# EAGLE design 8052 (EAGLE 9.3.0)
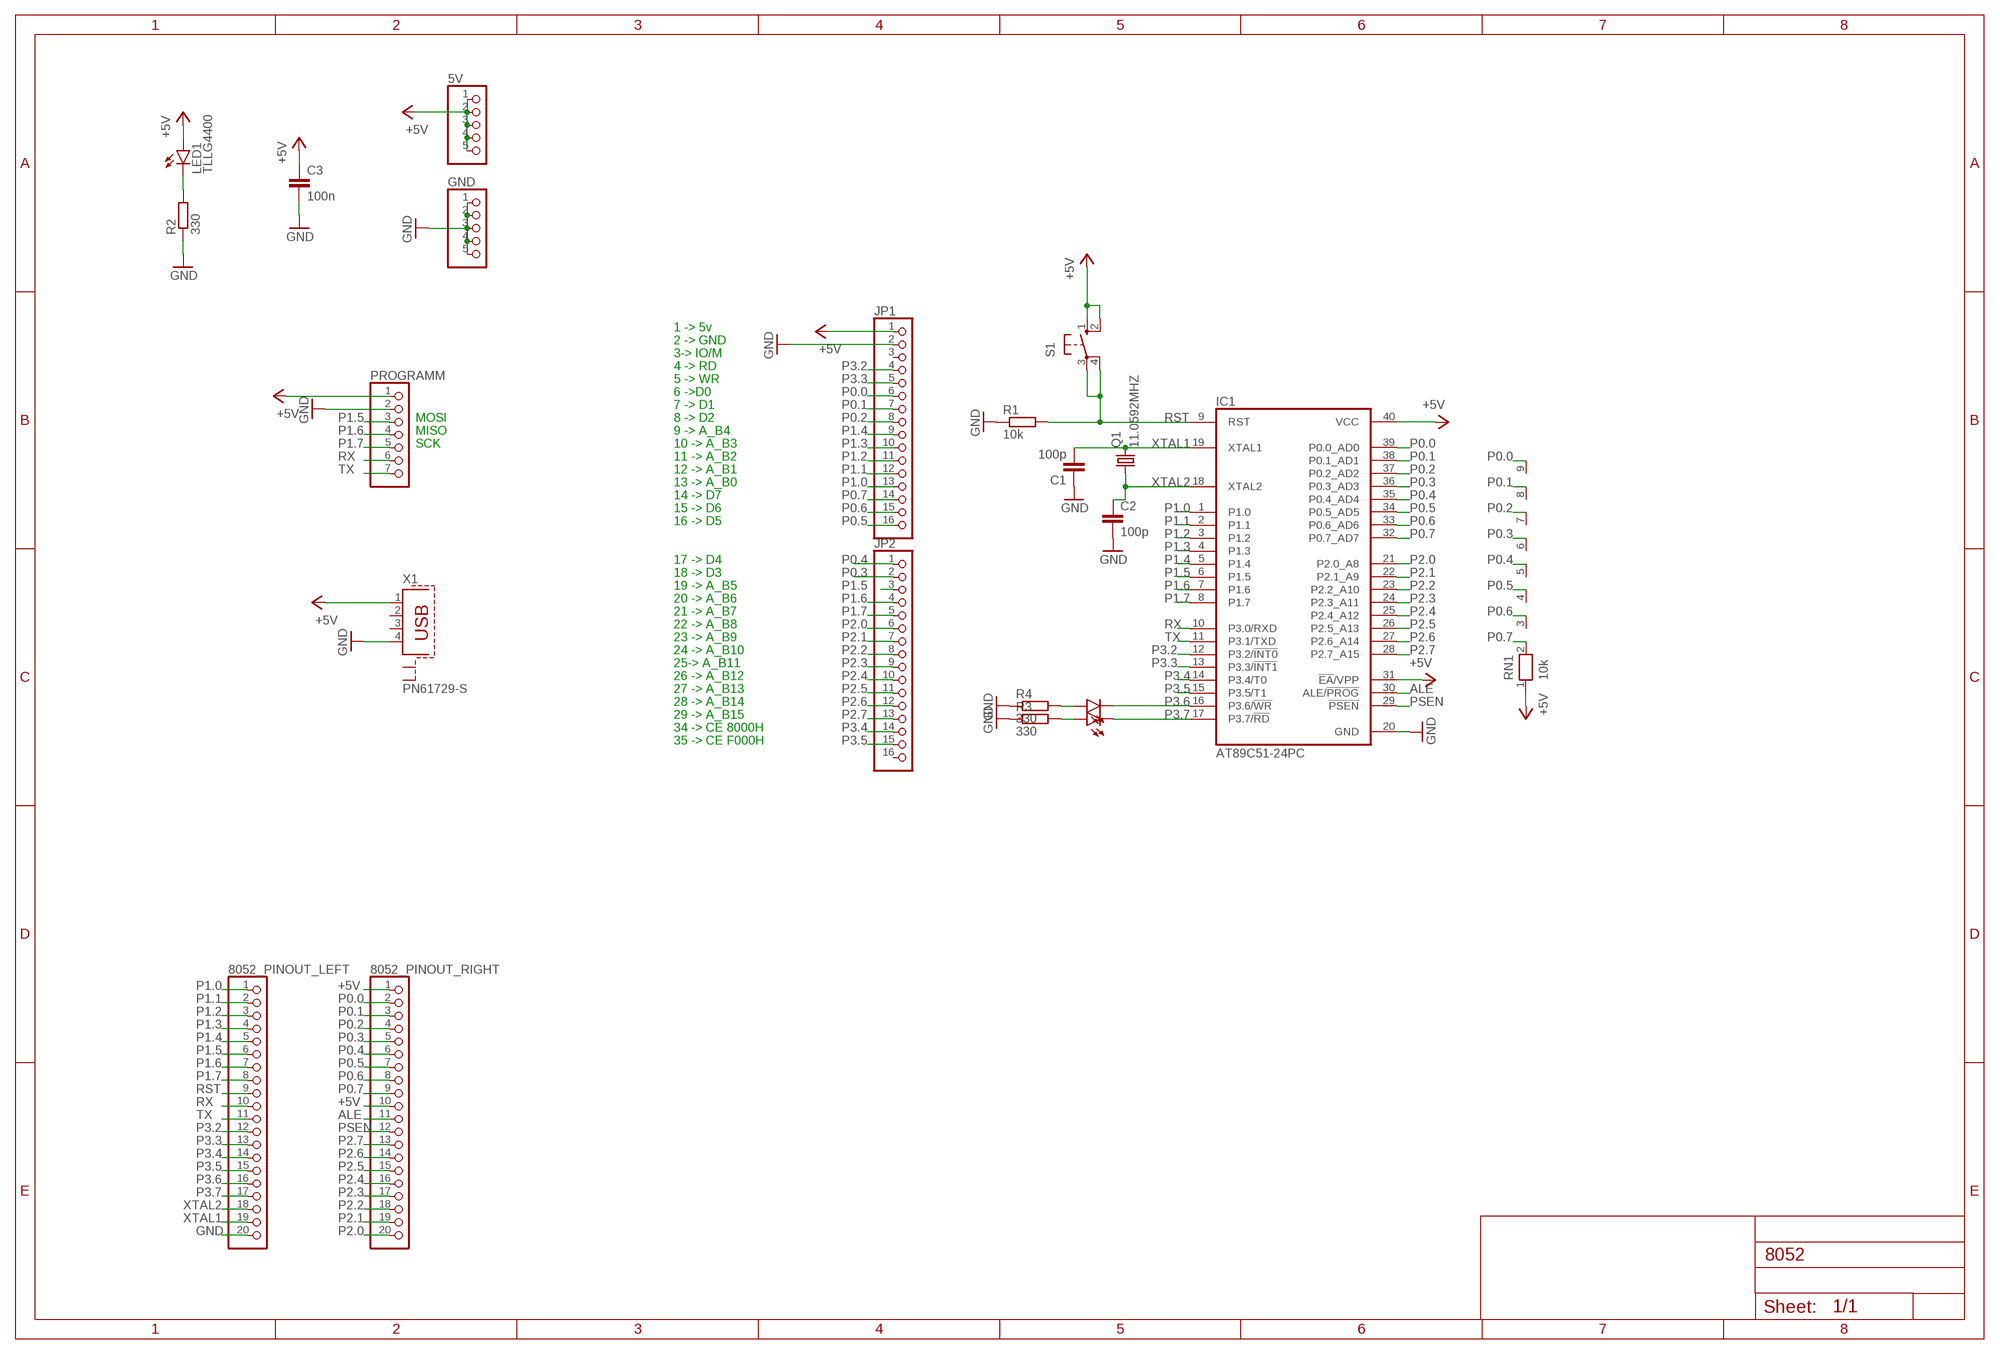
[diagram p0: schematic, sheet 1]

## Parts
5V  PINHD-1X5  [1X05]
8052_PINOUT_LEFT  PINHD-1X20  [1X20]
8052_PINOUT_RIGHT  PINHD-1X20  [1X20]
C1  100p  C-EU025-024X044  [C025-024X044]
C2  100p  C-EU025-024X044  [C025-024X044]
C3  100n  C-EU025-025X050  [C025-025X050]
GND  PINHD-1X5  [1X05]
IC1  AT89C51-24PC  [DIL40]
JP1  PINHD-1X16  [1X16]
JP2  PINHD-1X16  [1X16]
LED1  TLLG4400  [LED3MM]
LED2  TLLG4400  [LED3MM]
LED3  TLLG4400  [LED3MM]
PROGRAMM  PINHD-1X7/90  [1X07/90]
Q1  11.0592MHZ  CRYSTALHC49S  [HC49/S]
R1  10k  R-EU_0207/7  [0207/7]
R2  330  R-EU_0207/7  [0207/7]
R3  330  R-EU_0207/7  [0207/7]
R4  330  R-EU_0207/7  [0207/7]
RN1  10k  RN08  [RN-9]
S1  10-XX  [B3F-10XX]
X1  PN61729-S  [PN61729-S]

## Nets
+5V: 5V.1 5V.2 5V.3 5V.4 5V.5 8052_PINOUT_RIGHT.1 8052_PINOUT_RIGHT.10 C3.1 IC1.31(!EA!/VPP) IC1.40(VCC) JP1.1 LED1.A PROGRAMM.1 RN1.1 S1.1(S) S1.2(S1) X1.1
ALE: 8052_PINOUT_RIGHT.11 IC1.30(ALE/!PROG)
GND: 8052_PINOUT_LEFT.20 C1.1 C2.2 C3.2 GND.1 GND.2 GND.3 GND.4 GND.5 IC1.20(GND) JP1.2 PROGRAMM.2 R1.1 R2.1 R3.1 R4.1 X1.4
N$1: LED1.K(C) R2.2
N$2: LED3.A R3.2
N$3: LED2.A R4.2
P0.0: 8052_PINOUT_RIGHT.2 IC1.39(P0.0_AD0) JP1.6 RN1.9
P0.1: 8052_PINOUT_RIGHT.3 IC1.38(P0.1_AD1) JP1.7 RN1.8
P0.2: 8052_PINOUT_RIGHT.4 IC1.37(P0.2_AD2) JP1.8 RN1.7
P0.3: 8052_PINOUT_RIGHT.5 IC1.36(P0.3_AD3) JP2.2 RN1.6
P0.4: 8052_PINOUT_RIGHT.6 IC1.35(P0.4_AD4) JP2.1 RN1.5
P0.5: 8052_PINOUT_RIGHT.7 IC1.34(P0.5_AD5) JP1.16 RN1.4
P0.6: 8052_PINOUT_RIGHT.8 IC1.33(P0.6_AD6) JP1.15 RN1.3
P0.7: 8052_PINOUT_RIGHT.9 IC1.32(P0.7_AD7) JP1.14 RN1.2
P1.0: 8052_PINOUT_LEFT.1 IC1.1(P1.0) JP1.13
P1.1: 8052_PINOUT_LEFT.2 IC1.2(P1.1) JP1.12
P1.2: 8052_PINOUT_LEFT.3 IC1.3(P1.2) JP1.11
P1.3: 8052_PINOUT_LEFT.4 IC1.4(P1.3) JP1.10
P1.4: 8052_PINOUT_LEFT.5 IC1.5(P1.4) JP1.9
P1.5: 8052_PINOUT_LEFT.6 IC1.6(P1.5) JP2.3 PROGRAMM.3
P1.6: 8052_PINOUT_LEFT.7 IC1.7(P1.6) JP2.4 PROGRAMM.4
P1.7: 8052_PINOUT_LEFT.8 IC1.8(P1.7) JP2.5 PROGRAMM.5
P2.0: 8052_PINOUT_RIGHT.20 IC1.21(P2.0_A8) JP2.6
P2.1: 8052_PINOUT_RIGHT.19 IC1.22(P2.1_A9) JP2.7
P2.2: 8052_PINOUT_RIGHT.18 IC1.23(P2.2_A10) JP2.8
P2.3: 8052_PINOUT_RIGHT.17 IC1.24(P2.3_A11) JP2.9
P2.4: 8052_PINOUT_RIGHT.16 IC1.25(P2.4_A12) JP2.10
P2.5: 8052_PINOUT_RIGHT.15 IC1.26(P2.5_A13) JP2.11
P2.6: 8052_PINOUT_RIGHT.14 IC1.27(P2.6_A14) JP2.12
P2.7: 8052_PINOUT_RIGHT.13 IC1.28(P2.7_A15) JP2.13
P3.2: 8052_PINOUT_LEFT.12 IC1.12(P3.2/!INT0) JP1.4
P3.3: 8052_PINOUT_LEFT.13 IC1.13(P3.3/!INT1) JP1.5
P3.4: 8052_PINOUT_LEFT.14 IC1.14(P3.4/T0) JP2.14
P3.5: 8052_PINOUT_LEFT.15 IC1.15(P3.5/T1) JP2.15
P3.6: 8052_PINOUT_LEFT.16 IC1.16(P3.6/!WR) LED2.K(C)
P3.7: 8052_PINOUT_LEFT.17 IC1.17(P3.7/!RD) LED3.K(C)
PSEN: 8052_PINOUT_RIGHT.12 IC1.29(!PSEN)
RST: 8052_PINOUT_LEFT.9 IC1.9(RST) R1.2 S1.3(P) S1.4(P1)
RX: 8052_PINOUT_LEFT.10 IC1.10(P3.0/RXD) PROGRAMM.6
TX: 8052_PINOUT_LEFT.11 IC1.11(P3.1/TXD) PROGRAMM.7
XTAL1: 8052_PINOUT_LEFT.19 C1.2 IC1.19(XTAL1) Q1.2
XTAL2: 8052_PINOUT_LEFT.18 C2.1 IC1.18(XTAL2) Q1.1
Unconnected: JP1.3 JP2.16 X1.2 X1.3 X1.S1 X1.S2

## Notes on the sheet
- 1 -> 5v
- 2 -> GND
- 3-> IO/M
- 4 -> RD
- 5 -> WR
- 6 ->D0
- 7 -> D1
- MOSI | 8 -> D2
- MISO | 9 -> A_B4
- SCK | 10 -> A_B3
- 11 -> A_B2
- 12 -> A_B1
- 13 -> A_B0
- 14 -> D7
- 15 -> D6
- 16 -> D5
- 17 -> D4
- 18 -> D3
- 19 -> A_B5
- 20 -> A_B6
- 21 -> A_B7
- 22 -> A_B8
- 23 -> A_B9
- 24 -> A_B10
- 25-> A_B11
- 26 -> A_B12
- 27 -> A_B13
- 28 -> A_B14
- 29 -> A_B15
- 34 -> CE 8000H
- 35 -> CE F000H

## Library data of the parts
5V GND = pinhead:PINHD-1X5: PIN HEADER
8052_PINOUT_LEFT 8052_PINOUT_RIGHT = pinhead:PINHD-1X20: PIN HEADER
C1-C3 = rcl:C-EU: CAPACITOR, European symbol; SPICEPREFIX: C
IC1 = atmel:AT89C51-*: 8-bit Microcontroller with 4K Bytes Flash Not Recommended for New Designs. Use AT89S51. Source: http://www.atmel.com/dyn/resources/prod_documents/doc0265.; OC_FARNELL: unknown; OC_NEWARK: unknown
JP1 JP2 = pinhead:PINHD-1X16: PIN HEADER
LED1-LED3 = led:TLLG4400: Low Current (2mA) LED 3 mm Tinted Diffused Package color GREEN Source: Data sheet <http://www.farnell.com/datasheets/391098.pdf>; MF: VISHAY SEMICONDUCTOR; OC_FARNELL: 1612435
PROGRAMM = pinhead:PINHD-1X7: PIN HEADER
Q1 = crystal:CRYSTAL: CRYSTAL; OC_FARNELL: 1667008; OC_NEWARK: unknown
R1-R4 = rcl:R-EU_: RESISTOR, European symbol; SPICEPREFIX: R
RN1 = resistor-net:RN08: RESISTOR NETWORK; OC_FARNELL: unknown; OC_NEWARK: unknown
S1 = switch-omron:10-XX: OMRON SWITCH; MPN: B3F-1000; OC_FARNELL: 176432; OC_NEWARK: 36M3542
X1 = con-berg:PN61729-S: BERG USB connector; OC_FARNELL: unknown; OC_NEWARK: unknown

## Net classes
0 default: width 0.6 mm, drill 0.8 mm, clearance 0.5 mm

## Board
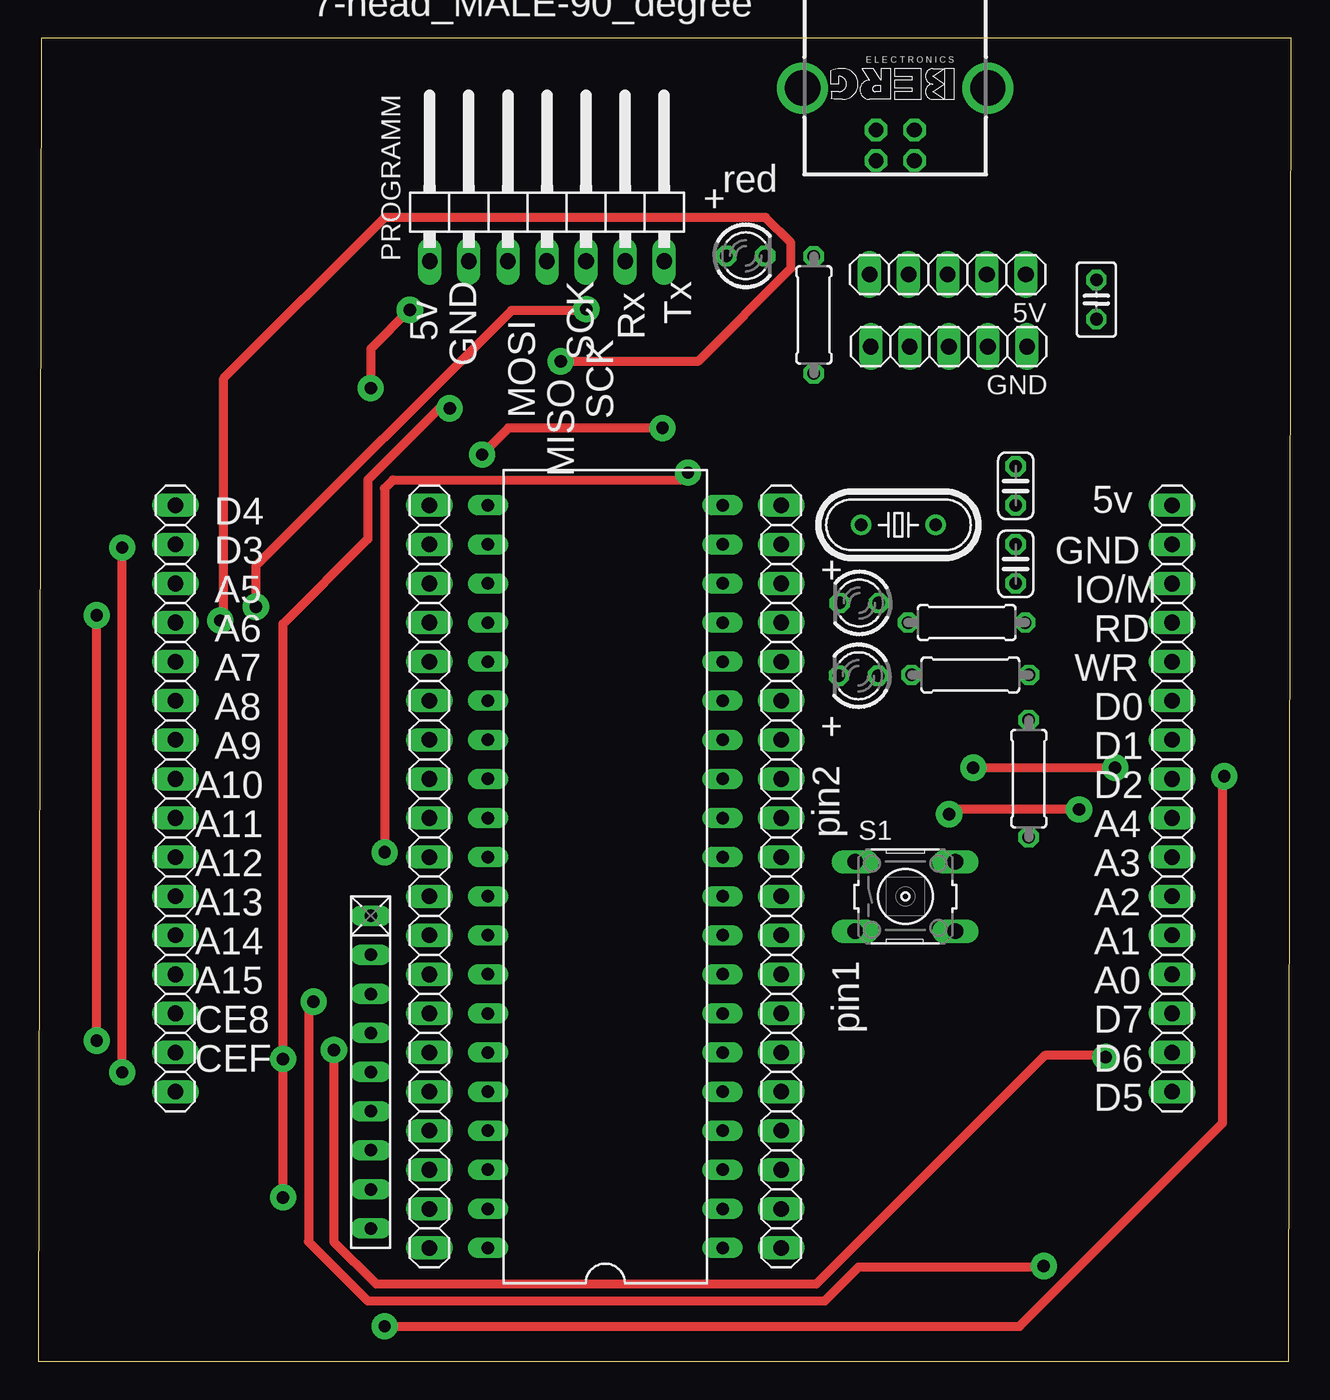
[diagram p1: board, top side]
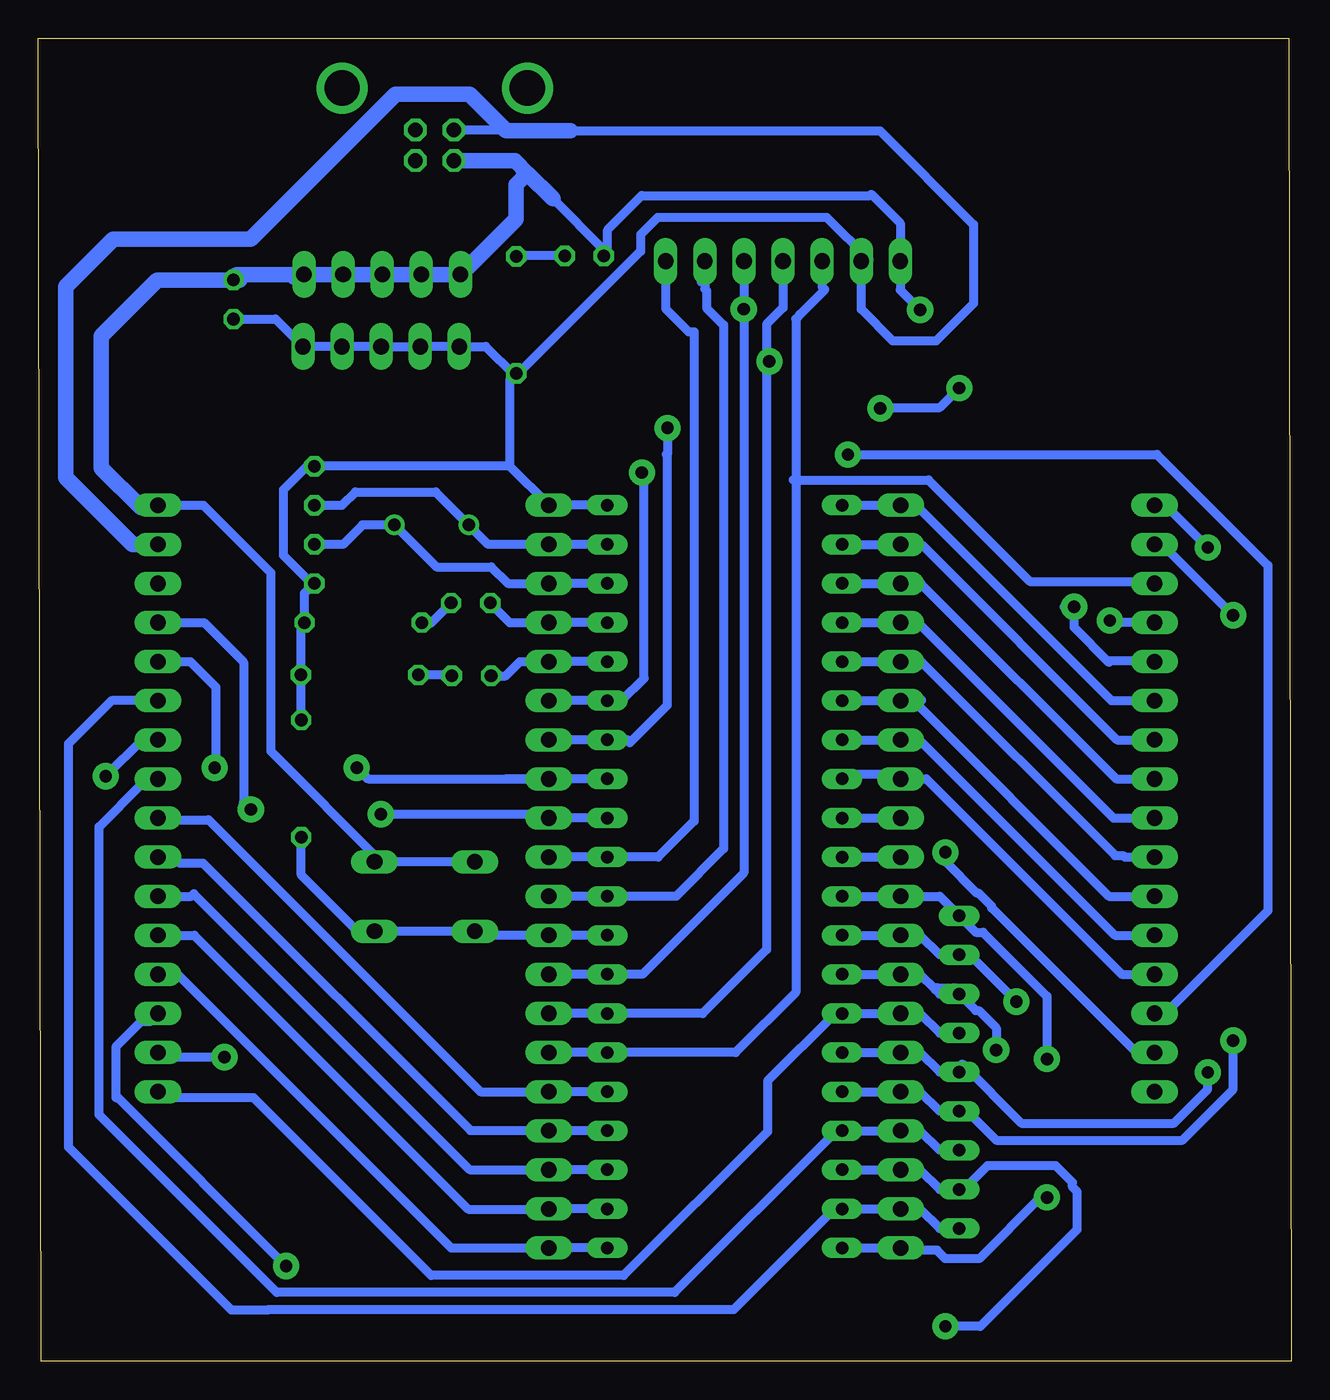
[diagram p2: board, bottom side, seen from below]

Size 81.42 x 85.94 mm. Coordinates in mm from the lower left corner, seen from the top.
Outline: 0,0 81.24,0 81.42,85.94 0.18,85.94 0,0
Copper layers (1*16): Top 0.035mm / dielectric 1.5mm / Bottom 0.035mm
Design rules "default": minimum track width 6mil, minimum drill 0.35mm, track to track 6mil, track to pad 6mil, pad to pad 6mil, via to via 6mil, smd to smd 6mil, copper to edge 40mil, drill to drill 6mil, minimum pad ring 10mil, minimum via ring 8mil, stop-mask expansion 4mil, vias tented up to drill 0mil, thermal gap 10mil
tRestrict: area 20.3,7.3 to 22.9,31.5; area 41.9,6.1 to 50.8,56.9; area 71.1,16.2 to 76.2,58.1; area 53.3,76.8 to 58.3,81; area 52.5,68.8 to 65.7,72.7; area 52.7,64.1 to 65.9,67.7; area 67.4,66.5 to 70.1,71.5; area 52.3,53.3 to 55,55.3; area 56.9,53.2 to 59.6,55.5; area 62.5,54.7 to 64.6,59.1; area 62.5,49.9 to 64.7,53.9; area 62.8,47.1 to 65.5,48.9; 14 more areas

### Footprints (pad centres in the part's own frame; a part is rotated, then mirrored left to right if it is on the bottom)
1X05 = drill 1.016 long: 1 -5.08,0; 2 -2.54,0; 3 0,0; 4 2.54,0; 5 5.08,0
1X20 = drill 1.016 long: 1 -24.13,0; 2 -21.59,0; 3 -19.05,0; 4 -16.51,0; 5 -13.97,0; 6 -11.43,0; 7 -8.89,0; 8 -6.35,0; 9 -3.81,0; 10 -1.27,0; 11 1.27,0; 12 3.81,0; 13 6.35,0; 14 8.89,0; 15 11.43,0; 16 13.97,0; 17 16.51,0; 18 19.05,0; 19 21.59,0; 20 24.13,0
C025-024X044 = drill 0.813 octagon: 1 -1.27,0; 2 1.27,0
C025-025X050 = drill 0.813 octagon: 1 -1.27,0; 2 1.27,0
DIL40 = drill 0.813 long: 1 -24.13,-7.62; 2 -21.59,-7.62; 3 -19.05,-7.62; 4 -16.51,-7.62; 5 -13.97,-7.62; 6 -11.43,-7.62; 7 -8.89,-7.62; 8 -6.35,-7.62; 9 -3.81,-7.62; 10 -1.27,-7.62; 11 1.27,-7.62; 12 3.81,-7.62; 13 6.35,-7.62; 14 8.89,-7.62; 15 11.43,-7.62; 16 13.97,-7.62; 17 16.51,-7.62; 18 19.05,-7.62; 19 21.59,-7.62; 20 24.13,-7.62; 21 24.13,7.62; 22 21.59,7.62; 23 19.05,7.62; 24 16.51,7.62; 25 13.97,7.62; 26 11.43,7.62; 27 8.89,7.62; 28 6.35,7.62; 29 3.81,7.62; 30 1.27,7.62; 31 -1.27,7.62; 32 -3.81,7.62; 33 -6.35,7.62; 34 -8.89,7.62; 35 -11.43,7.62; 36 -13.97,7.62; 37 -16.51,7.62; 38 -19.05,7.62; 39 -21.59,7.62; 40 -24.13,7.62
1X16 = drill 1.016 long: 1 -19.05,0; 2 -16.51,0; 3 -13.97,0; 4 -11.43,0; 5 -8.89,0; 6 -6.35,0; 7 -3.81,0; 8 -1.27,0; 9 1.27,0; 10 3.81,0; 11 6.35,0; 12 8.89,0; 13 11.43,0; 14 13.97,0; 15 16.51,0; 16 19.05,0
LED3MM = drill 0.813 octagon: A -1.27,0; K 1.27,0
1X07/90 = drill 1.016 long: 1 -7.62,-3.81; 2 -5.08,-3.81; 3 -2.54,-3.81; 4 0,-3.81; 5 2.54,-3.81; 6 5.08,-3.81; 7 7.62,-3.81
HC49/S = drill 0.813: 1 -2.413,0; 2 2.413,0
0207/7 = drill 0.813 octagon: 1 -3.81,0; 2 3.81,0
RN-9 = drill 0.813 long: 1 -10.16,0; 2 -7.62,0; 3 -5.08,0; 4 -2.54,0; 5 0,0; 6 2.54,0; 7 5.08,0; 8 7.62,0; 9 10.16,0
B3F-10XX = drill 1.016 long: 1 -3.251,2.261; 2 3.251,2.261; 3 -3.251,-2.261; 4 3.251,-2.261
PN61729-S = drill 0.95 octagon: 1 1.25,4.71; 2 -1.25,4.71; 3 -1.25,2.71; 4 1.25,2.71 | drill 2.3 pad 2.9: S1 -6.02,0; S2 6.02,0

### Placement (x,y rotation side)
5V  59.08,70.6 180 top
8052_PINOUT_LEFT  48.26,31.47 90 top
8052_PINOUT_RIGHT  25.4,31.47 90 top
C1  63.5,56.87 270 top
C2  63.5,51.79 270 top
C3  68.74,68.97 270 top
GND  59.16,65.92 180 top
IC1  36.83,31.47 90 top
JP1  73.66,36.55 270 top
JP2  8.89,36.55 270 top
LED1  45.96,71.82 0 top
LED2  53.28,44.52 180 top
LED3  53.34,49.25 180 top
PROGRAMM  33.04,75.27 0 top
Q1  55.88,54.33 180 top
R1  64.35,37.84 270 top
R2  50.38,67.98 90 top
R3  60.32,47.98 180 top
R4  60.55,44.58 180 top
RN1  21.59,18.77 270 top
S1  56.33,30.19 0 top
X1  55.67,82.71 180 top

### Tracks (layer width: path | path; a pad name or v marks a point on that pad's centre or on a via)
+5V  (via drill 0.8 pad 1.7)
  Top 0.6: v15.89,10.63 v15.89,19.63 15.89,47.9 21.39,53.4 21.39,57.25 26.38,62.24 v26.72,61.9 | v24.13,68.3 21.59,65.76 v21.59,63.22
  Bottom 0.6: IC1.31 8052_PINOUT_RIGHT.10 22.86,30.2 RN1.1 | IC1.40 8052_PINOUT_RIGHT.1 25.24,7.2 23.04,7.2 22.49,6.65 20.29,6.65 16.32,10.63 v15.89,10.63 | S1.1 59.14,32.45 | 59.14,32.45 S1.2 | 5V.1 64.57,70.6 | 64.57,70.6 64.99,70.6 | 47.99,75.53 44.69,72.22 LED1.A 44.43,72.07 44.43,73.51 42.22,75.72 27.4,75.72 27.3,75.82 25.42,73.94 PROGRAMM.1 25.42,69.6 v24.13,68.3 | C3.1 68.33,70.24 | 64.93,70.24 64.57,70.6 | JP1.1 70.71,55.6 66.32,51.22 66.32,39.62 59.14,32.45 | RN1.1 21.39,29.2 | RN1.1 20.51,27.85 20.04,27.85 15.89,23.7 v15.89,19.63 | v21.59,63.22 22.86,61.95 26.67,61.95 v26.72,61.9
  Bottom 1: X1.1 50.47,78 49.66,77.19 | 49.66,77.19 47.99,75.53 | 49.66,77.19 50.4,76.45 50.4,74.2 5V.5 5V.4 5V.3 5V.2 5V.1 68.53,70.6 68.89,70.24 | JP1.1 74.6,55.6 74.75,55.45 77.34,58.03 77.34,66.61 73.7,70.24 68.89,70.24 | 68.89,70.24 68.33,70.24
ALE
  Bottom 0.6: IC1.30 8052_PINOUT_RIGHT.11
GND
  Bottom 0.6: IC1.20 8052_PINOUT_LEFT.20 50.8,58.14 | 50.8,58.14 C1.1 63.98,58.14 65.52,56.6 65.52,52.37 63.68,50.52 C2.2 64.13,49.9 R3.1 64.36,47.75 R4.1 64.35,44.57 R1.1 | 50.5,64.05 R2.1 49.99,64.4 42.29,72.1 42.29,73.2 41.19,74.3 30.19,74.3 27.44,71.55 PROGRAMM.2 27.96,68.34 25.9,66.28 23.09,66.28 20.66,68.71 20.66,73.85 26.74,79.93 47.52,79.93 | 50.5,64.05 50.8,63.75 50.8,58.14 | 50.5,64.05 52.36,65.92 GND.5 GND.4 GND.3 GND.2 GND.1 66.02,67.7 C3.2 | X1.4 50.54,80 50.47,79.93
  Bottom 1: JP1.2 75.3,53.06 79.64,57.4 79.64,69.82 76.57,72.89 67.63,72.89 58.22,82.31 53.4,82.31 51.03,79.93 50.47,79.93 47.52,79.93 46.84,79.93
N$1
  Bottom 0.6: LED1.K 50.35,71.82 R2.2
N$2
  Bottom 0.6: LED3.A 55.88,47.98 R3.2
N$3
  Bottom 0.6: LED2.A 54.61,44.58 R4.2
P0.0
  Bottom 0.6: RN1.9 22.86,8.61 24.13,9.88 8052_PINOUT_RIGHT.2 IC1.39 29.64,9.95 36.24,3.35 66.49,3.35 66.53,3.32 68.89,3.32 79.47,13.9 79.47,40.11 76.68,42.9 JP1.6
P0.1  (via drill 0.8 pad 1.7)
  Top 0.6: v22.49,2.25 63.74,2.25 76.94,15.45 76.94,38 v77.05,38
  Bottom 0.6: IC1.38 8052_PINOUT_RIGHT.3 24.13,12.42 22.86,11.15 RN1.8 21.39,11.05 19.74,12.7 15.34,12.7 14.24,11.6 14.24,11.31 13.92,10.99 13.92,8.55 20.22,2.25 v22.49,2.25 | 74.74,40.2 74.19,40.2 JP1.7 74.69,40.36 v77.05,38
P0.2
  Bottom 0.6: RN1.7 22.86,13.69 24.13,14.96 8052_PINOUT_RIGHT.4 IC1.37 29.64,14.9 40.09,4.45 65.94,4.45 77.49,16 77.49,34.7 74.74,37.45 74.19,37.45 JP1.8
P0.3  (via drill 0.8 pad 1.7)
  Top 0.6: v3.79,20.82 v3.79,48.45
  Bottom 0.6: IC1.36 8052_PINOUT_RIGHT.5 24.13,17.5 22.86,16.23 RN1.6 21.39,16.55 19.19,14.35 7.09,14.35 3.79,17.65 v3.79,20.82 | 8.19,52.85 8.74,52.85 JP2.2 8.4,53.06 v3.79,48.45
P0.4  (via drill 0.8 pad 1.7)
  Top 0.6: v5.44,18.75 v5.44,52.85
  Bottom 0.6: IC1.35 8052_PINOUT_RIGHT.6 24.13,20.04 22.86,18.77 RN1.5 21.39,19.3 17.54,15.45 7.64,15.45 5.44,17.65 v5.44,18.75 | JP2.1 8.19,55.6 v5.44,52.85
P0.5
  Bottom 0.6: RN1.4 22.86,21.31 24.13,22.58 8052_PINOUT_RIGHT.7 IC1.34 29.64,22.6 34.04,18.2 34.04,14.9 43.39,5.55 55.9,5.55 67.45,17.1 73.64,17.1 JP1.16
P0.6  (via drill 0.8 pad 1.7)
  Top 0.6: v19.19,20.21 19.19,7.75 21.94,5 50.54,5 65.39,19.85 69.24,19.85 v69.34,19.75
  Bottom 0.6: IC1.33 8052_PINOUT_RIGHT.8 24.13,25.12 23.15,24.14 | 23.15,24.14 22.86,23.85 | 23.15,24.14 23.04,24.25 21.94,24.25 RN1.3 20.51,22.77 20.32,22.77 19.19,21.64 v19.19,20.21 | JP1.15 73.37,19.75 v69.34,19.75
P0.7  (via drill 0.8 pad 1.7)
  Top 0.6: v17.87,23.35 17.54,23.02 17.54,7.75 21.39,3.9 51.09,3.9 53.29,6.1 65.39,6.1 v65.32,6.17
  Bottom 0.6: IC1.32 8052_PINOUT_RIGHT.9 24.13,27.66 22.86,26.39 RN1.2 | JP1.14 74.19,22.05 74.74,22.05 76.39,20.4 76.39,17.1 76.26,17.1 v65.32,6.17 | 21.39,26.45 RN1.2 | RN1.2 20.91,26.39 v17.87,23.35
P1.0
  Bottom 0.6: IC1.1 8052_PINOUT_LEFT.1 54.6,7.34 72.37,25.11 73.65,25.11 JP1.13
P1.1
  Bottom 0.6: IC1.2 47.36,9.88 | 47.36,9.88 8052_PINOUT_LEFT.2 | JP1.12 71.3,27.66 53.5,9.87 47.38,9.87 47.36,9.88
P1.2
  Bottom 0.6: IC1.3 8052_PINOUT_LEFT.3 53.4,12.42 71.33,30.36 71.49,30.2 JP1.11
P1.3
  Bottom 0.6: IC1.4 8052_PINOUT_LEFT.4 53.36,14.98 70.74,32.36 72.22,32.36 72.61,32.74 JP1.10
P1.4
  Bottom 0.6: IC1.5 8052_PINOUT_LEFT.5 52.71,17.5 70.37,35.17 73.55,35.17 JP1.9
P1.5
  Bottom 0.6: 8052_PINOUT_LEFT.6 IC1.6 36.13,20.04 32.21,23.96 32.21,57.25 | PROGRAMM.3 30.5,69.8 30.33,69.62 31.94,68 31.94,67.98 32.21,67.71 32.21,57.25 | 32.21,57.25 23.59,57.25 16.99,50.65 9.29,50.65 JP2.3 | 32.39,57.25 32.21,57.25
P1.6  (via drill 0.8 pad 1.7)
  Top 0.6: v33.93,64.95 42.84,64.95 48.89,71 48.89,72.65 47.24,74.3 22.49,74.3 12.04,63.85 12.04,48.35 v11.8,48.11 11.73,48.04 11.73,48.05 11.91,48.23 12.03,48.23
  Bottom 0.6: 8052_PINOUT_LEFT.7 IC1.7 38.26,22.58 34.1,26.75 34.1,64.95 | PROGRAMM.4 33.04,68.43 34.1,67.37 34.1,64.95 | v33.93,64.95 34.1,64.95 | JP2.4 11.67,47.98 v11.8,48.11
P1.7  (via drill 0.8 pad 1.7)
  Top 0.6: v14.13,49 14.13,51.64 30.74,68.25 35.69,68.25 v35.59,68.35
  Bottom 0.6: 8052_PINOUT_LEFT.8 IC1.8 42.18,25.12 35.58,31.72 35.58,68.25 35.69,68.25 v35.59,68.35 v35.58,68.36 PROGRAMM.5 | 14.79,49 14.54,48.76 14.37,48.76 v14.13,49 14.13,47.66 11.86,45.4 11.77,45.5 8.94,45.5 JP2.5
P2.0
  Bottom 0.6: IC1.21 8052_PINOUT_RIGHT.20 24.4,55.6 11.7,42.9 JP2.6
P2.1
  Bottom 0.6: IC1.22 8052_PINOUT_RIGHT.19 25.35,53.01 24,53.01 11.35,40.36 JP2.7
P2.2
  Bottom 0.6: IC1.23 8052_PINOUT_RIGHT.18 25.37,50.49 24.06,50.49 11.4,37.82 JP2.8
P2.3
  Bottom 0.6: IC1.24 8052_PINOUT_RIGHT.17 24.28,47.98 11.58,35.28 JP2.9
P2.4
  Bottom 0.6: IC1.25 8052_PINOUT_RIGHT.16 24.2,45.44 24.13,45.52 11.46,32.85 10.93,32.85 10.82,32.74 JP2.10
P2.5
  Bottom 0.6: IC1.26 8052_PINOUT_RIGHT.15 | 8052_PINOUT_RIGHT.15 24.05,42.9 24.02,42.94 | 8052_PINOUT_RIGHT.15 24.57,42.9 11.87,30.2 JP2.11
P2.6
  Bottom 0.6: IC1.27 8052_PINOUT_RIGHT.14 24.17,40.36 11.47,27.66 JP2.12
P2.7
  Bottom 0.6: IC1.28 28.9,38.14 25.71,38.14 8052_PINOUT_RIGHT.13 23.73,37.82 11.03,25.12 JP2.13
P3.2  (via drill 0.8 pad 1.7)
  Top 0.6: v67.62,35.84 59.48,35.84 v59.18,35.54
  Bottom 0.6: IC1.12 8052_PINOUT_LEFT.12 48.51,35.54 v59.18,35.54 | JP1.4 70.66,47.98 68.1,45.42 68.1,36.32 v67.62,35.84
P3.3  (via drill 0.8 pad 1.7)
  Top 0.6: v69.97,38.55 v60.74,38.55
  Bottom 0.6: IC1.13 8052_PINOUT_LEFT.13 | 8052_PINOUT_LEFT.13 51.04,37.82 | JP1.5 71.56,45.44 69.91,43.79 69.91,38.61 v69.97,38.55 | v60.74,38.55 60.02,37.82 8052_PINOUT_LEFT.13
P3.4  (via drill 0.8 pad 1.7)
  Top 0.6: v28.82,58.9 30.55,60.63 v40.55,60.63
  Bottom 0.6: 8052_PINOUT_LEFT.14 IC1.14 43.18,40.36 43,40.19 40.56,42.62 40.56,58.9 | v28.82,58.9 8.74,58.9 1.54,51.7 1.54,29.26 8.19,22.6 8.74,22.6 JP2.14 | 40.64,58.9 40.56,58.9 | v40.55,60.63 40.55,58.91 40.56,58.9
P3.5  (via drill 0.8 pad 1.7)
  Top 0.6: v22.49,33.05 22.49,56.7 23.04,57.25 41.74,57.25 v42.21,57.72
  Bottom 0.6: 8052_PINOUT_LEFT.15 IC1.15 43.53,42.9 42.07,44.36 42.07,57.8 | 42.29,57.8 42.07,57.8 | v42.21,57.72 42.15,57.72 42.07,57.8 | JP2.15 10.09,20.04 19.47,29.43 19.47,29.54 20.32,30.39 20.44,30.39 22.49,32.45 v22.49,33.05
P3.6
  Bottom 0.6: IC1.16 8052_PINOUT_LEFT.16 50.13,45.44 51.05,44.52 LED2.K
P3.7
  Bottom 0.6: IC1.17 8052_PINOUT_LEFT.17 50.8,47.98 LED3.K
PSEN
  Bottom 0.6: IC1.29 8052_PINOUT_RIGHT.12
RST
  Bottom 0.6: IC1.9 8052_PINOUT_LEFT.9 52.82,27.66 S1.3 S1.4 60.7,27.92 64.35,31.58 R1.2
RX
  Bottom 0.6: 8052_PINOUT_LEFT.10 IC1.10 39.99,30.2 36.9,33.3 36.9,67.32 38,68.43 38,69.54 38.12,69.66 PROGRAMM.6 38.12,70.36 38.35,70.13
TX
  Bottom 0.6: 8052_PINOUT_LEFT.11 IC1.11 41.16,32.74 38.82,35.08 38.82,66.88 39.17,66.88 40.68,68.39 40.66,68.4 PROGRAMM.7
XTAL1
  Bottom 0.6: IC1.19 8052_PINOUT_LEFT.19 52.2,53.06 Q1.2 55.6,56.47 60.82,56.47 61.69,55.6 C1.2
XTAL2
  Bottom 0.6: IC1.18 8052_PINOUT_LEFT.18 50.92,50.52 52,51.6 55.56,51.6 Q1.1 60.37,54.33 61.64,53.06 C2.1

### Text on the board
tPlace: 7-head_MALE-90_degree | + | + | + | pin2 | pin1
tNames: red | GND | SCK | Tx | 5v | MOSI | SCK | Rx | MISO | 5v | D4 | D3 | GND | A5 | IO/M | A6 | RD | A7 | WR | A8 | D0 | A9 | D1 | A10 | D2 | A11 | A4 | A12 | A3 | A13 | A2 | A14 | A1 | A15 | A0 | CE8 | D7 | CEF | D6 | D5